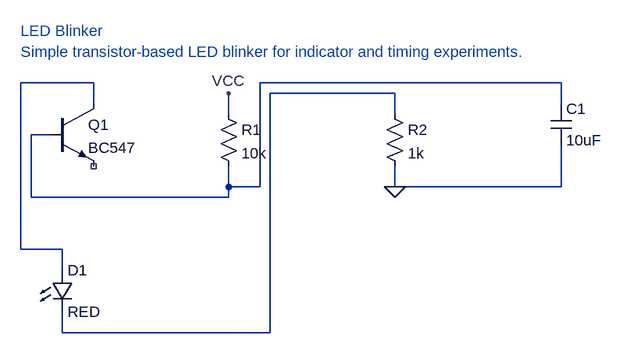
[diagram p0: schematic led_blinker.asc]
led_blinker.asc, the LTspice schematic file:
Version 4
SHEET 1 1200 800
TEXT 16 16 Left 2 ;LED Blinker
TEXT 16 48 Left 2 ;Simple transistor-based LED blinker for indicator and timing experiments.
SYMBOL npn 64 128 R0
SYMATTR InstName Q1
SYMATTR Value BC547
SYMBOL res 320 128 R0
SYMATTR InstName R1
SYMATTR Value 10k
SYMBOL res 576 128 R0
SYMATTR InstName R2
SYMATTR Value 1k
SYMBOL cap 832 128 R0
SYMATTR InstName C1
SYMATTR Value 10uF
SYMBOL led 64 384 R0
SYMATTR InstName D1
SYMATTR Value RED
FLAG 336 112 VCC
WIRE 336 112 336 144
WIRE 32 176 32 272
WIRE 32 176 64 176
WIRE 32 272 336 272
WIRE 336 224 336 256
WIRE 336 256 336 272
WIRE 336 256 384 256
WIRE 384 96 384 256
WIRE 384 96 848 96
WIRE 848 96 848 128
WIRE 16 96 16 352
WIRE 16 96 128 96
WIRE 16 352 80 352
WIRE 80 352 80 384
WIRE 128 96 128 128
WIRE 80 448 80 480
WIRE 80 480 400 480
WIRE 400 112 400 480
WIRE 400 112 592 112
WIRE 592 112 592 144
FLAG 592 256 0
WIRE 592 224 592 256
WIRE 592 256 848 256
WIRE 848 192 848 224
WIRE 848 224 848 256

The netlist it stands for:
* led_blinker.asc
Q1 N002 N001 NC_01 0 BC547
R1 VCC N001 10k
R2 N003 0 1k
C1 N001 0 10uF
D1 N002 N003 RED
.model D D
.lib standard.dio
.model NPN NPN
.model PNP PNP
.lib standard.bjt
* LED Blinker
* Simple transistor-based LED blinker for indicator and timing experiments.
.backanno
.end